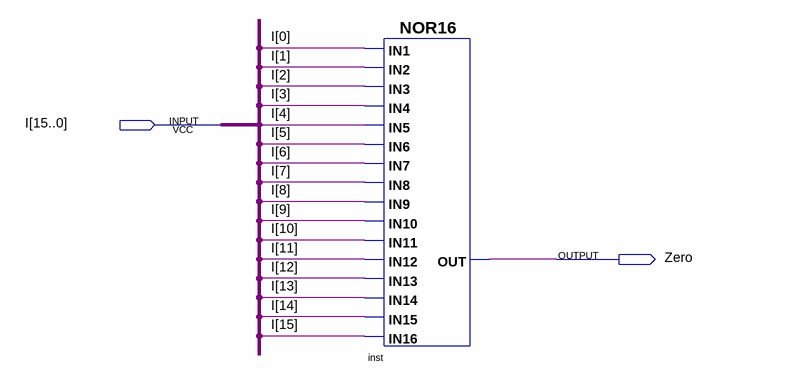
[diagram p0: schematic sheet]
// Quartus schematic SoSanh0.bdf as structural Verilog: 1 symbols, 2 pins
module SoSanh0 (
  input  [15:0] I,
  output Zero
);

  nor inst (Zero, I[0], I[1], I[2], I[3], I[4], I[5], I[6], I[7], I[8], I[9], I[10], I[11], I[12], I[13], I[14], I[15]);
endmodule
